# Altium project EORE Integrated System - R4.PrjPcb
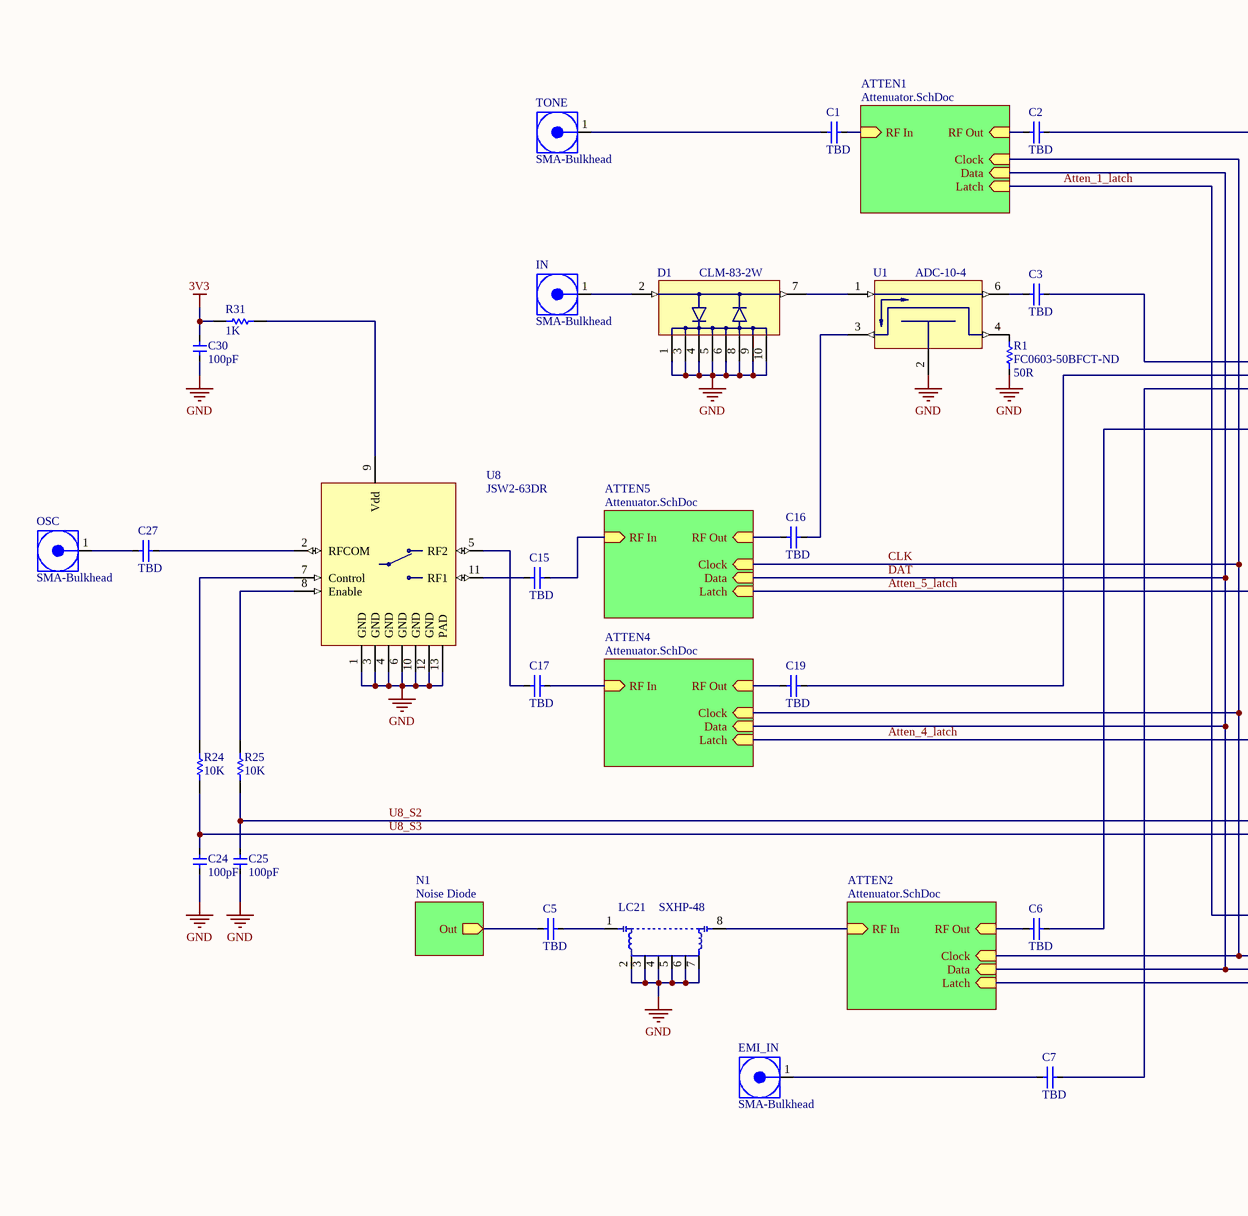
[diagram p0: Main.SchDoc, left]
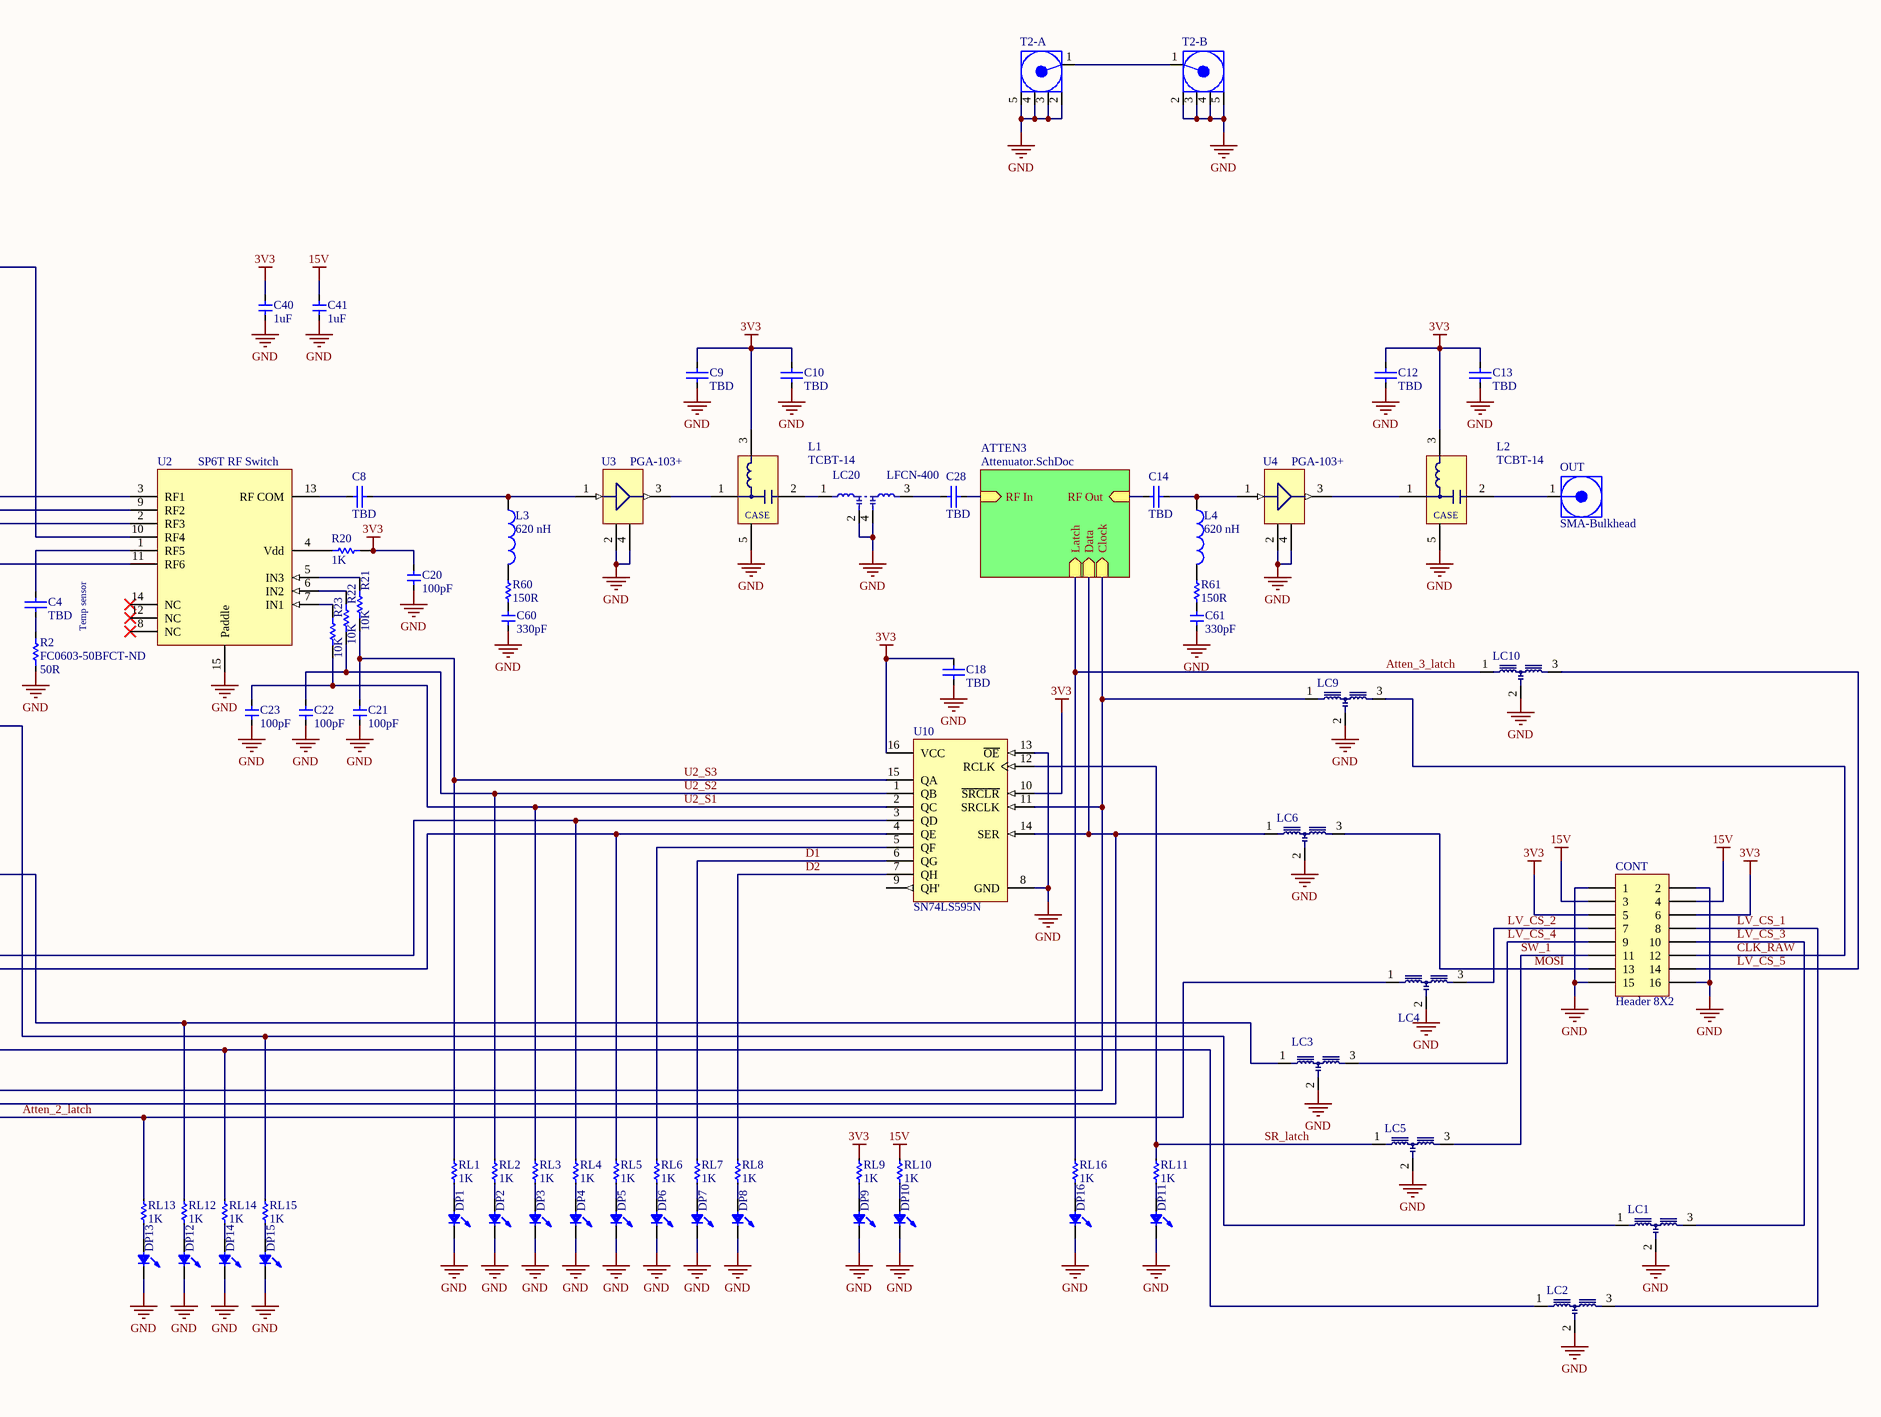
[diagram p1: Main.SchDoc, right]
1 sheet, 103 parts. Net scope: hierarchical (ports join the sheet entries above them; power ports are global).
Board file: Main.PcbDoc

## Sheet Main.SchDoc
size 635 x 279 mm; SheetNumber: 1

### Parts
C1  value TBD  [0402C]  (hidden comment: Cap)
C2  value TBD  [0402C]  (hidden comment: Cap)
C3  value TBD  [0402C]  (hidden comment: Cap)
C4  value TBD  [0402C]  (hidden comment: Cap)
C5  value TBD  [0402C]  (hidden comment: Cap)
C6  value TBD  [0402C]  (hidden comment: Cap)
C7  value TBD  [0402C]  (hidden comment: Cap)
C8  value TBD  [0402C]  (hidden comment: Cap)
C9  value TBD  [0805C]  (hidden comment: Cap)
C10  value TBD  [0805C]  (hidden comment: Cap)
C12  value TBD  [0805C]  (hidden comment: Cap)
C13  value TBD  [0805C]  (hidden comment: Cap)
C14  value TBD  [0402C]  (hidden comment: Cap)
C15  value TBD  [0402C]  (hidden comment: Cap)
C16  value TBD  [0402C]  (hidden comment: Cap)
C17  value TBD  [0402C]  (hidden comment: Cap)
C18  value TBD  [0603C]  (hidden comment: Cap)
C19  value TBD  [0402C]  (hidden comment: Cap)
C20  value 100pF  [0603C]  (hidden comment: SMT Cap)
C21  value 100pF  [0603C]  (hidden comment: SMT Cap)
C22  value 100pF  [0603C]  (hidden comment: SMT Cap)
C23  value 100pF  [0603C]  (hidden comment: SMT Cap)
C24  value 100pF  [0603C]  (hidden comment: SMT Cap)
C25  value 100pF  [0603C]  (hidden comment: SMT Cap)
C27  value TBD  [0402C]  (hidden comment: Cap)
C28  value TBD  [0402C]  (hidden comment: Cap)
C30  value 100pF  [0603C]  (hidden comment: SMT Cap)
C40  value 1uF  [V]  (hidden comment: SMT Cap)
C41  value 1uF  [V]  (hidden comment: SMT Cap)
C60  value 330pF  [0603C]  (hidden comment: SMT Cap)
C61  value 330pF  [0603C]  (hidden comment: SMT Cap)
CONT  Header 8X2  [5103310-3]
D1  CLM-83-2W  [DL1721]
DP1  LED0  [0603 SMT LED]  (value not drawn)
DP2  LED0  [0603 SMT LED]  (value not drawn)
DP3  LED0  [0603 SMT LED]  (value not drawn)
DP4  LED0  [0603 SMT LED]  (value not drawn)
DP5  LED0  [0603 SMT LED]  (value not drawn)
DP6  LED0  [0603 SMT LED]  (value not drawn)
DP7  LED0  [0603 SMT LED]  (value not drawn)
DP8  LED0  [0603 SMT LED]  (value not drawn)
DP9  LED0  [0603 SMT LED]  (value not drawn)
DP10  LED0  [0603 SMT LED]  (value not drawn)
DP11  LED0  [0603 SMT LED]  (value not drawn)
DP12  LED0  [0603 SMT LED]  (value not drawn)
DP13  LED0  [0603 SMT LED]  (value not drawn)
DP14  LED0  [0603 SMT LED]  (value not drawn)
DP15  LED0  [0603 SMT LED]  (value not drawn)
DP16  LED0  [0603 SMT LED]  (value not drawn)
EMI_IN  SMA-Bulkhead  [1052902-1]
IN  SMA-Bulkhead  [1052902-1]
L1  TCBT-14  [GU1414]
L2  TCBT-14  [GU1414]
L3  620 nH  [1008L]
L4  620 nH  [1008L]
LC1  MEM2012F  [MEM2012S LC Filter]  (value not drawn)
LC2  MEM2012F  [MEM2012S LC Filter]  (value not drawn)
LC3  MEM2012F  [MEM2012S LC Filter]  (value not drawn)
LC4  MEM2012F  [MEM2012S LC Filter]  (value not drawn)
LC5  MEM2012F  [MEM2012S LC Filter]  (value not drawn)
LC6  MEM2012F  [MEM2012S LC Filter]  (value not drawn)
LC9  MEM2012F  [MEM2012S LC Filter]  (value not drawn)
LC10  MEM2012F  [MEM2012S LC Filter]  (value not drawn)
LC20  LFCN-400  [FV1206]
LC21  SXHP-48  [HF1139]
OSC  SMA-Bulkhead  [1052902-1]
OUT  SMA-Bulkhead  [1052902-1]
R1  FC0603-50BFCT-ND  value 50R  [0603R]
R2  FC0603-50BFCT-ND  value 50R  [0603R]
R20  value 1K  [0603R]  (hidden comment: RES Semi)
R21  value 10K  [0603R]  (hidden comment: RES Semi)
R22  value 10K  [0603R]  (hidden comment: RES Semi)
R23  value 10K  [0603R]  (hidden comment: RES Semi)
R24  value 10K  [0603R]  (hidden comment: RES Semi)
R25  value 10K  [0603R]  (hidden comment: RES Semi)
R31  value 1K  [0603R]  (hidden comment: RES Semi)
R60  value 150R  [0603R]  (hidden comment: Res Semi Small)
R61  value 150R  [0603R]  (hidden comment: Res Semi Small)
RL1  value 1K  [0603R]  (hidden comment: Res Semi Small)
RL2  value 1K  [0603R]  (hidden comment: Res Semi Small)
RL3  value 1K  [0603R]  (hidden comment: Res Semi Small)
RL4  value 1K  [0603R]  (hidden comment: Res Semi Small)
RL5  value 1K  [0603R]  (hidden comment: Res Semi Small)
RL6  value 1K  [0603R]  (hidden comment: Res Semi Small)
RL7  value 1K  [0603R]  (hidden comment: Res Semi Small)
RL8  value 1K  [0603R]  (hidden comment: Res Semi Small)
RL9  value 1K  [0603R]  (hidden comment: Res Semi Small)
RL10  value 1K  [0603R]  (hidden comment: Res Semi Small)
RL11  value 1K  [0603R]  (hidden comment: Res Semi Small)
RL12  value 1K  [0603R]  (hidden comment: Res Semi Small)
RL13  value 1K  [0603R]  (hidden comment: Res Semi Small)
RL14  value 1K  [0603R]  (hidden comment: Res Semi Small)
RL15  value 1K  [0603R]  (hidden comment: Res Semi Small)
RL16  value 1K  [0603R]  (hidden comment: Res Semi Small)
T2-A  COAX-M  [SMT RA SMA Connector]  (value not drawn)
T2-B  COAX-M  [SMT RA SMA Connector]  (value not drawn)
TONE  SMA-Bulkhead  [1052902-1]
U1  ADC-10-4  [CD542]
U2  SP6T RF Switch  [MT1817]
U3  PGA-103+  [DF782]
U4  PGA-103+  [DF782]
U8  JSW2-63DR  [MT1818]
U10  SN74LS595N  [SOIC127P602-16BN]

### Sub-sheets
ATTEN1 = Attenuator.SchDoc (file not in this document): RF In (in), RF Out (in), Clock (in), Data (in), Latch (in)
ATTEN2 = Attenuator.SchDoc (file not in this document): RF In (in), RF Out (in), Clock (in), Data (in), Latch (in)
ATTEN3 = Attenuator.SchDoc (file not in this document): RF In (in), RF Out (in), Clock (in), Data (in), Latch (in)
ATTEN4 = Attenuator.SchDoc (file not in this document): RF In (in), RF Out (in), Clock (in), Data (in), Latch (in)
ATTEN5 = Attenuator.SchDoc (file not in this document): RF In (in), RF Out (in), Clock (in), Data (in), Latch (in)
N1 = Noise Diode (file not in this document): Out

### Nets
3V3: C9.2 C10.2 C12.2 C13.2 C18.2 C20.2 C30.2 C40.1 CONT.5 CONT.6 L1.3(DC) L2.3(DC) R20.2 R31.2 RL9.1 U10.10(~{SRCLR}) U10.16(VCC)
15V: C41.1 CONT.3 CONT.4 RL10.1
GND: C9.1 C10.1 C12.1 C13.1 C18.1 C20.1 C21.1 C22.1 C23.1 C24.1 C25.1 C30.1 C40.2 C41.2 C60.2 C61.2 CONT.1 CONT.2 CONT.15 CONT.16 D1.1(Gnd) D1.3(Gnd) D1.4(Gnd) D1.5(Gnd) D1.6(Gnd) D1.8(Gnd) D1.9(Gnd) D1.10(Gnd) DP1.2 DP2.2 DP3.2 DP4.2 DP5.2 DP6.2 DP7.2 DP8.2 DP9.2 DP10.2 DP11.2 DP12.2 DP13.2 DP14.2 DP15.2 DP16.2 L1.5(CASE) L2.5(CASE) LC1.2 LC2.2 LC3.2 LC4.2 LC5.2 LC6.2 LC9.2 LC10.2 LC20.2 LC20.4 LC21.2 LC21.3 LC21.4 LC21.5 LC21.6 LC21.7 R1.1 R2.1 T2-A.2(GND) T2-A.3(GND) T2-A.4(GND) T2-A.5(GND) T2-B.2(GND) T2-B.3(GND) T2-B.4(GND) T2-B.5(GND) U1.2(Gnd) U2.15(Paddle) U3.2(Gnd) U3.4(Gnd) U4.2(Gnd) U4.4(Gnd) U8.1(GND) U8.3(GND) U8.4(GND) U8.6(GND) U8.10(GND) U8.12(GND) U8.13(PAD) U10.8(GND) U10.13(~{OE})
Atten_1_latch: LC2.1 RL14.1 ; sheet ATTEN1/Latch
Atten_2_latch: LC4.1 RL13.1 ; sheet ATTEN2/Latch
Atten_3_latch: LC10.1 RL16.1 ; sheet ATTEN3/Latch
Atten_4_latch: LC3.1 RL12.1 ; sheet ATTEN4/Latch
Atten_5_latch: LC1.1 RL15.1 ; sheet ATTEN5/Latch
CLK: LC9.1 U10.11(SRCLK) ; sheet ATTEN1/Clock, sheet ATTEN2/Clock, sheet ATTEN3/Clock, sheet ATTEN4/Clock, sheet ATTEN5/Clock
CLK_RAW: CONT.12 LC9.3
D1: RL7.1 U10.6(QG)
D2: RL8.1 U10.7(QH)
DAT: LC6.1 U10.14(SER) ; sheet ATTEN1/Data, sheet ATTEN2/Data, sheet ATTEN3/Data, sheet ATTEN4/Data, sheet ATTEN5/Data
LV_CS_1: CONT.8 LC2.3
LV_CS_2: CONT.7 LC4.3
LV_CS_3: CONT.10 LC1.3
LV_CS_4: CONT.9 LC3.3
LV_CS_5: CONT.14 LC10.3
MOSI: CONT.13 LC6.3
SR_latch: LC5.1 RL11.1 U10.12(RCLK)
SW_1: CONT.11 LC5.3
U2_S1: C23.2 R23.2 RL3.1 U10.2(QC)
U2_S2: C22.2 R22.2 RL2.1 U10.1(QB)
U2_S3: C21.2 R21.2 RL1.1 U10.15(QA)
U8_S2: C25.2 R25.1 RL4.1 U10.3(QD)
U8_S3: C24.2 R24.1 RL5.1 U10.4(QE)
NetC1_1: C1.1 TONE.1(Signal)
NetC1_2: C1.2 ; sheet ATTEN1/RF In
NetC2_1: C2.1 ; sheet ATTEN1/RF Out
NetC2_2: C2.2 U2.10(RF4)
NetC3_1: C3.1 U1.6(Output)
NetC3_2: C3.2 U2.3(RF1)
NetC4_1: C4.1 R2.2
NetC4_2: C4.2 U2.1(RF5)
NetC5_1: C5.1 ; sheet N1/Out
NetC5_2: C5.2 LC21.1
NetC6_1: C6.1 ; sheet ATTEN2/RF Out
NetC6_2: C6.2 U2.11(RF6)
NetC7_1: C7.1 EMI_IN.1(Signal)
NetC7_2: C7.2 U2.2(RF3)
NetC8_1: C8.1 U2.13(RF_COM)
NetC8_2: C8.2 L3.1 U3.1(In)
NetC14_1: C14.1 ; sheet ATTEN3/RF Out
NetC14_2: C14.2 L4.1 U4.1(In)
NetC15_1: C15.1 U8.11(RF1)
NetC15_2: C15.2 ; sheet ATTEN5/RF In
NetC16_1: C16.1 ; sheet ATTEN5/RF Out
NetC16_2: C16.2 U1.3(Coupled)
NetC17_1: C17.1 U8.5(RF2)
NetC17_2: C17.2 ; sheet ATTEN4/RF In
NetC19_1: C19.1 ; sheet ATTEN4/RF Out
NetC19_2: C19.2 U2.9(RF2)
NetC27_1: C27.1 OSC.1(Signal)
NetC27_2: C27.2 U8.2(RFCOM)
NetC28_1: C28.1 LC20.3
NetC28_2: C28.2 ; sheet ATTEN3/RF In
NetC60_1: C60.1 R60.2
NetC61_1: C61.1 R61.2
NetD1_2: D1.2(In) IN.1(Signal)
NetD1_7: D1.7(Gnd) U1.1(Input)
NetDP1_1: DP1.1 RL1.2
NetDP2_1: DP2.1 RL2.2
NetDP3_1: DP3.1 RL3.2
NetDP4_1: DP4.1 RL4.2
NetDP5_1: DP5.1 RL5.2
NetDP6_1: DP6.1 RL6.2
NetDP7_1: DP7.1 RL7.2
NetDP8_1: DP8.1 RL8.2
NetDP9_1: DP9.1 RL9.2
NetDP10_1: DP10.1 RL10.2
NetDP11_1: DP11.1 RL11.2
NetDP12_1: DP12.1 RL12.2
NetDP13_1: DP13.1 RL13.2
NetDP14_1: DP14.1 RL14.2
NetDP15_1: DP15.1 RL15.2
NetDP16_1: DP16.1 RL16.2
NetL1_1: L1.1(RF+DC) U3.3(Gnd)
NetL1_2: L1.2(RF) LC20.1
NetL2_1: L2.1(RF+DC) U4.3(Gnd)
NetL2_2: L2.2(RF) OUT.1(Signal)
NetL3_2: L3.2 R60.1
NetL4_2: L4.2 R61.1
NetLC21_8: LC21.8 ; sheet ATTEN2/RF In
NetR1_2: R1.2 U1.4(Termination)
NetR20_1: R20.1 U2.4(Vdd)
NetR21_1: R21.1 U2.5(IN3)
NetR22_1: R22.1 U2.6(IN2)
NetR23_1: R23.1 U2.7(IN1)
NetR24_2: R24.2 U8.7(Control)
NetR25_2: R25.2 U8.8(Enable)
NetR31_1: R31.1 U8.9(Vdd)
NetRL6_1: RL6.1 U10.5(QF)
NetT2-A_1: T2-A.1(Signal) T2-B.1(Signal)

Not connected (* = marked no-connect by the designer): L1 4(NC); L2 4(NC); U1 5(DNC); U2 8(NC)* 12(NC)* 14(NC)*; U10 9(QH')

### Notes on the sheet
- Temp sensor
- Title
- Size:
- Date:
- Tabloid
- Number:
- Time:
- Revision:
- Sheet
- of
- File:

### Library data of the parts
C1-C10 C12-C19 C27 C28 = Cap: Capacitor; Published: 8-Jun-2000; LatestRevisionDate: 17-Jul-2002; LatestRevisionNote: Re-released for DXP Platform.; PackageReference: RAD-0.3; Publisher: Altium Limited
C20-C25 C30 C40 C41 C60 C61 = Cap - SMT Small: Published: 8-Jun-2000; LatestRevisionDate: 29-May-2009; LatestRevisionNote: IPC-7351 Footprint Added.; PackageReference: C1206; Publisher: Altium Limited; PackageDescription: Chip Capacitor
CONT = Header 8X2: Header, 8-Pin, Dual row; LatestRevisionDate: 17-Jul-2002; LatestRevisionNote: Re-released for DXP Platform.; Publisher: Altium Limited
D1 = CLM-83-2W: +12 to +32 dBm RF Limiter
DP1-DP16 = LED0: T 1 3/4 LED; Published: 8-Jun-2000; LatestRevisionDate: 08-Jul-2005; LatestRevisionNote: Mech Layer 1 removed.; PackageReference: LED-0; Publisher: Altium Limited
EMI_IN IN OSC OUT TONE = SMA-Bulkhead: SMA Connector - Bulkhead
L1 L2 = TCBT-14: Surface Mount 10 MHz to 10 GHz Bias Tee
L3 L4 = Inductor: Code_IEC: 1005; Value: 10mH; Published: 8-Jun-2000; LatestRevisionDate: 29-May-2009; LatestRevisionNote: IPC-7351 Footprint Added.; PackageReference: 0402-A; Publisher: Altium Limited; PackageDescription: Chip Inductor; Code_JEITA: 0402
LC1-LC6 LC9 LC10 = MEM2012F - Signal Filter: Signal Line 3-terminal Filters
LC20 = LFCN-xxx Filter: Ceramic Low Pass Filter
LC21 = SXHP-xx Filter: Integrated High Pass Filter
R1 R2 = RES Semi: Published: 8-Jun-2000; LatestRevisionDate: 17-Jul-2002; LatestRevisionNote: Re-released for DXP Platform.; PackageReference: AXIAL-0.5; Publisher: Altium Limited
R20-R25 R31 = RES Semi: Semiconductor Resistor; Published: 8-Jun-2000; LatestRevisionDate: 17-Jul-2002; LatestRevisionNote: Re-released for DXP Platform.; PackageReference: AXIAL-0.5; Publisher: Altium Limited
R60 R61 RL1-RL16 = Res Semi Small: Semiconductor Resistor; Published: 8-Jun-2000; LatestRevisionDate: 17-Jul-2002; LatestRevisionNote: Re-released for DXP Platform.; PackageReference: AXIAL-0.5; Publisher: Altium Limited
T2-A T2-B = COAX-M: RF Coaxial PCB Connector, MMCX; Thru-Hole, Vertical Mount Plug,  50 Ohm Impedance; PackageDocument: Rev. A, 16-Jun-1997; PCB_Layout: Complies with manufacturer's recommendation.; DrillSize: Corresponds to nominal value.; Published: 15-Jul-2004; LatestRevisionDate: 15-Jul-2004; LatestRevisionNote: Component Replaced.; DatasheetDocument: 30-May-2003; PackageReference: 908-21103; Publisher: Altium Limited; ComponentLink1Description: Manufacturer Link; ComponentLink1URL: http://www.amphenolrf.com/
U1 = ADC-10-4: Surface Mount Directional Coupler
U2 = JSW6-33DR+: SP6T RF Switch 50Ω 10 to 2700 MHz
U3 U4 = PGA-103+: Ultra Linear Low Noise Monolithic Amplifier
U8 = JSW2-63DR: SPDT RF Switch
U10 = SN74LS595N: 8-Bit Shift Register with Output Latch; Published: 8-Jun-2000; LatestRevisionDate: 04-Mar-2005; LatestRevisionNote: Stylized 3D Model Added.; DatasheetVersion: Mar-1988; PackageVersion: Oct-1995; PackageReference: N016; Publisher: Altium Limited; PackageDescription: DIP; 16 Leads; Row Spacing 7.62 mm; Pitch 2.54 mm; Code_JEDEC: MS-001-BB; ComponentLink1Description: Manufacturer Link; ComponentLink1URL: http://www.ti.com/; ComponentLink2Description: Datasheet; ComponentLink2URL: http://www-s.ti.com/sc/ds/sn74ls596.pdf